# Altium project 摄像头转接板PCB.PrjPcb
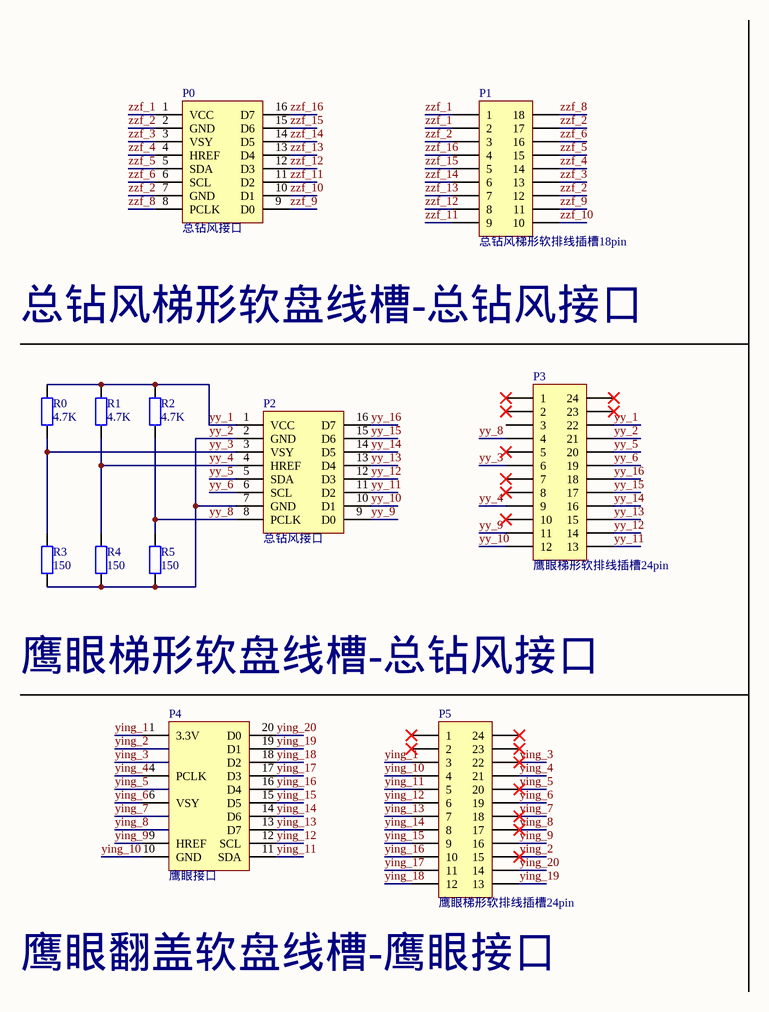
[diagram p0: 摄像头转接板原理图.SchDoc]
1 sheet, 12 parts. Net scope: global (net labels, ports and power ports of the same name join across sheets).
Board file: 摄像头转接板PCB.PcbDoc

## Sheet 摄像头转接板原理图.SchDoc
size A4

### Parts
P0  总钻风接口  [总钻风MT9V032]
P1  总钻风梯形软排线插槽18pin  [总钻风软排线梯形插槽-18pin]
P2  总钻风接口  [总钻风MT9V032]
P3  鹰眼梯形软排线插槽24pin  [鹰眼软排线梯形插槽-24pin]
P4  鹰眼接口  [山外OV7725插座]
P5  鹰眼梯形软排线插槽24pin  [鹰眼软排线梯形插槽-24pin]
R0  4.7K  [0805]
R1  4.7K  [0805]
R2  4.7K  [0805]
R3  150  [0805]
R4  150  [0805]
R5  150  [0805]

### Nets
ying_1: P4.1(3.3V) P5.3
ying_2: P5.15
ying_3: P5.22
ying_4: P4.4(PCLK) P5.21
ying_5: P5.20
ying_6: P4.6(VSY) P5.19
ying_7: P5.18
ying_8: P5.17
ying_9: P4.9(HREF) P5.16
ying_10: P4.10(GND) P5.4
ying_11: P4.11(SDA) P5.5
ying_12: P4.12(SCL) P5.6
ying_13: P4.13(D7) P5.7
ying_14: P4.14(D6) P5.8
ying_15: P4.15(D5) P5.9
ying_16: P4.16(D4) P5.10
ying_17: P4.17(D3) P5.11
ying_18: P4.18(D2) P5.12
ying_19: P4.19(D1) P5.13
ying_20: P4.20(D0) P5.14
yy_1: P2.1(VCC) P3.22 R0.1 R1.2 R2.2
yy_2: P2.2(GND) P2.7(GND) P3.21 R3.1 R4.1 R5.1
yy_3: P2.3(VSY) P3.6 R0.2 R3.2
yy_4: P2.4(HREF) P3.9 R1.1 R4.2
yy_5: P2.5(SDA) P3.20
yy_6: P2.6(SCL) P3.19
yy_8: P2.8(PCLK) P3.4 R2.1 R5.2
yy_9: P2.9(D0) P3.11
yy_10: P2.10(D1) P3.12
yy_11: P2.11(D2) P3.13
yy_12: P2.12(D3) P3.14
yy_13: P2.13(D4) P3.15
yy_14: P2.14(D5) P3.16
yy_15: P2.15(D6) P3.17
yy_16: P2.16(D7) P3.18
zzf_1: P0.1(VCC) P1.1 P1.2
zzf_2: P0.2(GND) P0.7(GND) P1.3 P1.12 P1.17
zzf_3: P0.3(VSY) P1.13
zzf_4: P0.4(HREF) P1.14
zzf_5: P0.5(SDA) P1.15
zzf_6: P0.6(SCL) P1.16
zzf_8: P0.8(PCLK) P1.18
zzf_9: P0.9(D0) P1.11
zzf_10: P0.10(D1) P1.10
zzf_11: P0.11(D2) P1.9
zzf_12: P0.12(D3) P1.8
zzf_13: P0.13(D4) P1.7
zzf_14: P0.14(D5) P1.6
zzf_15: P0.15(D6) P1.5
zzf_16: P0.16(D7) P1.4

Not connected (* = marked no-connect by the designer): P3 1* 2* 3 5* 7* 8* 10* 23* 24*; P5 1* 2* 23* 24*

### Notes on the sheet
- 总钻风梯形软盘线槽-总钻风接口
- 鹰眼梯形软盘线槽-总钻风接口
- 鹰眼翻盖软盘线槽-鹰眼接口

### Library data of the parts
P0 P2 = 总钻风MT9V032: LatestRevisionDate: 17-Jul-2002; LatestRevisionNote: Re-released for DXP Platform.; Publisher: Altium Limited
P1 = 梯形软排线插槽18pin: 软排线插槽, 18-Pin; LatestRevisionDate: 17-Jul-2002; LatestRevisionNote: Re-released for DXP Platform.; Publisher: Altium Limited
P3 = 梯形软排线插槽24pin: 软排线插槽, 24-Pin; LatestRevisionDate: 17-Jul-2002; LatestRevisionNote: Re-released for DXP Platform.; Publisher: Altium Limited
P4 = 山外OV7725: LatestRevisionDate: 17-Jul-2002; LatestRevisionNote: Re-released for DXP Platform.; Publisher: Altium Limited
P5 = 鹰眼梯形软排线插槽24pin: 软排线插槽, 24-Pin; LatestRevisionDate: 17-Jul-2002; LatestRevisionNote: Re-released for DXP Platform.; Publisher: Altium Limited
R0-R5 = R-0805